# Altium schematic sheet PROC106B_BT_DISPLAY.SchDoc: BREAKAWAY_SECTION3
size 431 x 279 mm; Date: Not shown in title block; ApprovedBy: Not shown in title block; CheckedBy: Not shown in title block; Author: Not shown in title block; CompanyName: Not shown in title block; DrawnBy: Antony/Anand Ram; Engineer: Not shown in title block; Organization: Not shown in title block; Address1: Not shown in title block; Address2: Not shown in title block; Address3: Not shown in title block; Address4: Not shown in title block; DocumentNumber: 9; Revision: Use project parameter SCH_Rev; SheetNumber: 9; SheetTotal: 12; PageSetup: Record=PageOptions|CenterHorizontal=True|CenterVertical=True|PrintScale=1.00|XCorrection=1.00|YCorrection=1.00|PrintKind=0|BorderSize=5000000|LeftOffset=0|BottomOffset=0|Orientation=2|PaperLength=1000|PaperWidth=1000|Scale=100|PaperSource=15|PrintQuality=600|MediaType=1|DitherType=10|PaperKind=Letter|PrintScaleMode=1; CurrentTime: Not shown in title block; CurrentDate: Not shown in title block; Time: Not shown in title block; DocumentFullPathAndName: Not shown in title block; DocumentName: Not shown in title block; ModifiedDate: Not shown in title block; ImagePath: Not shown in title block
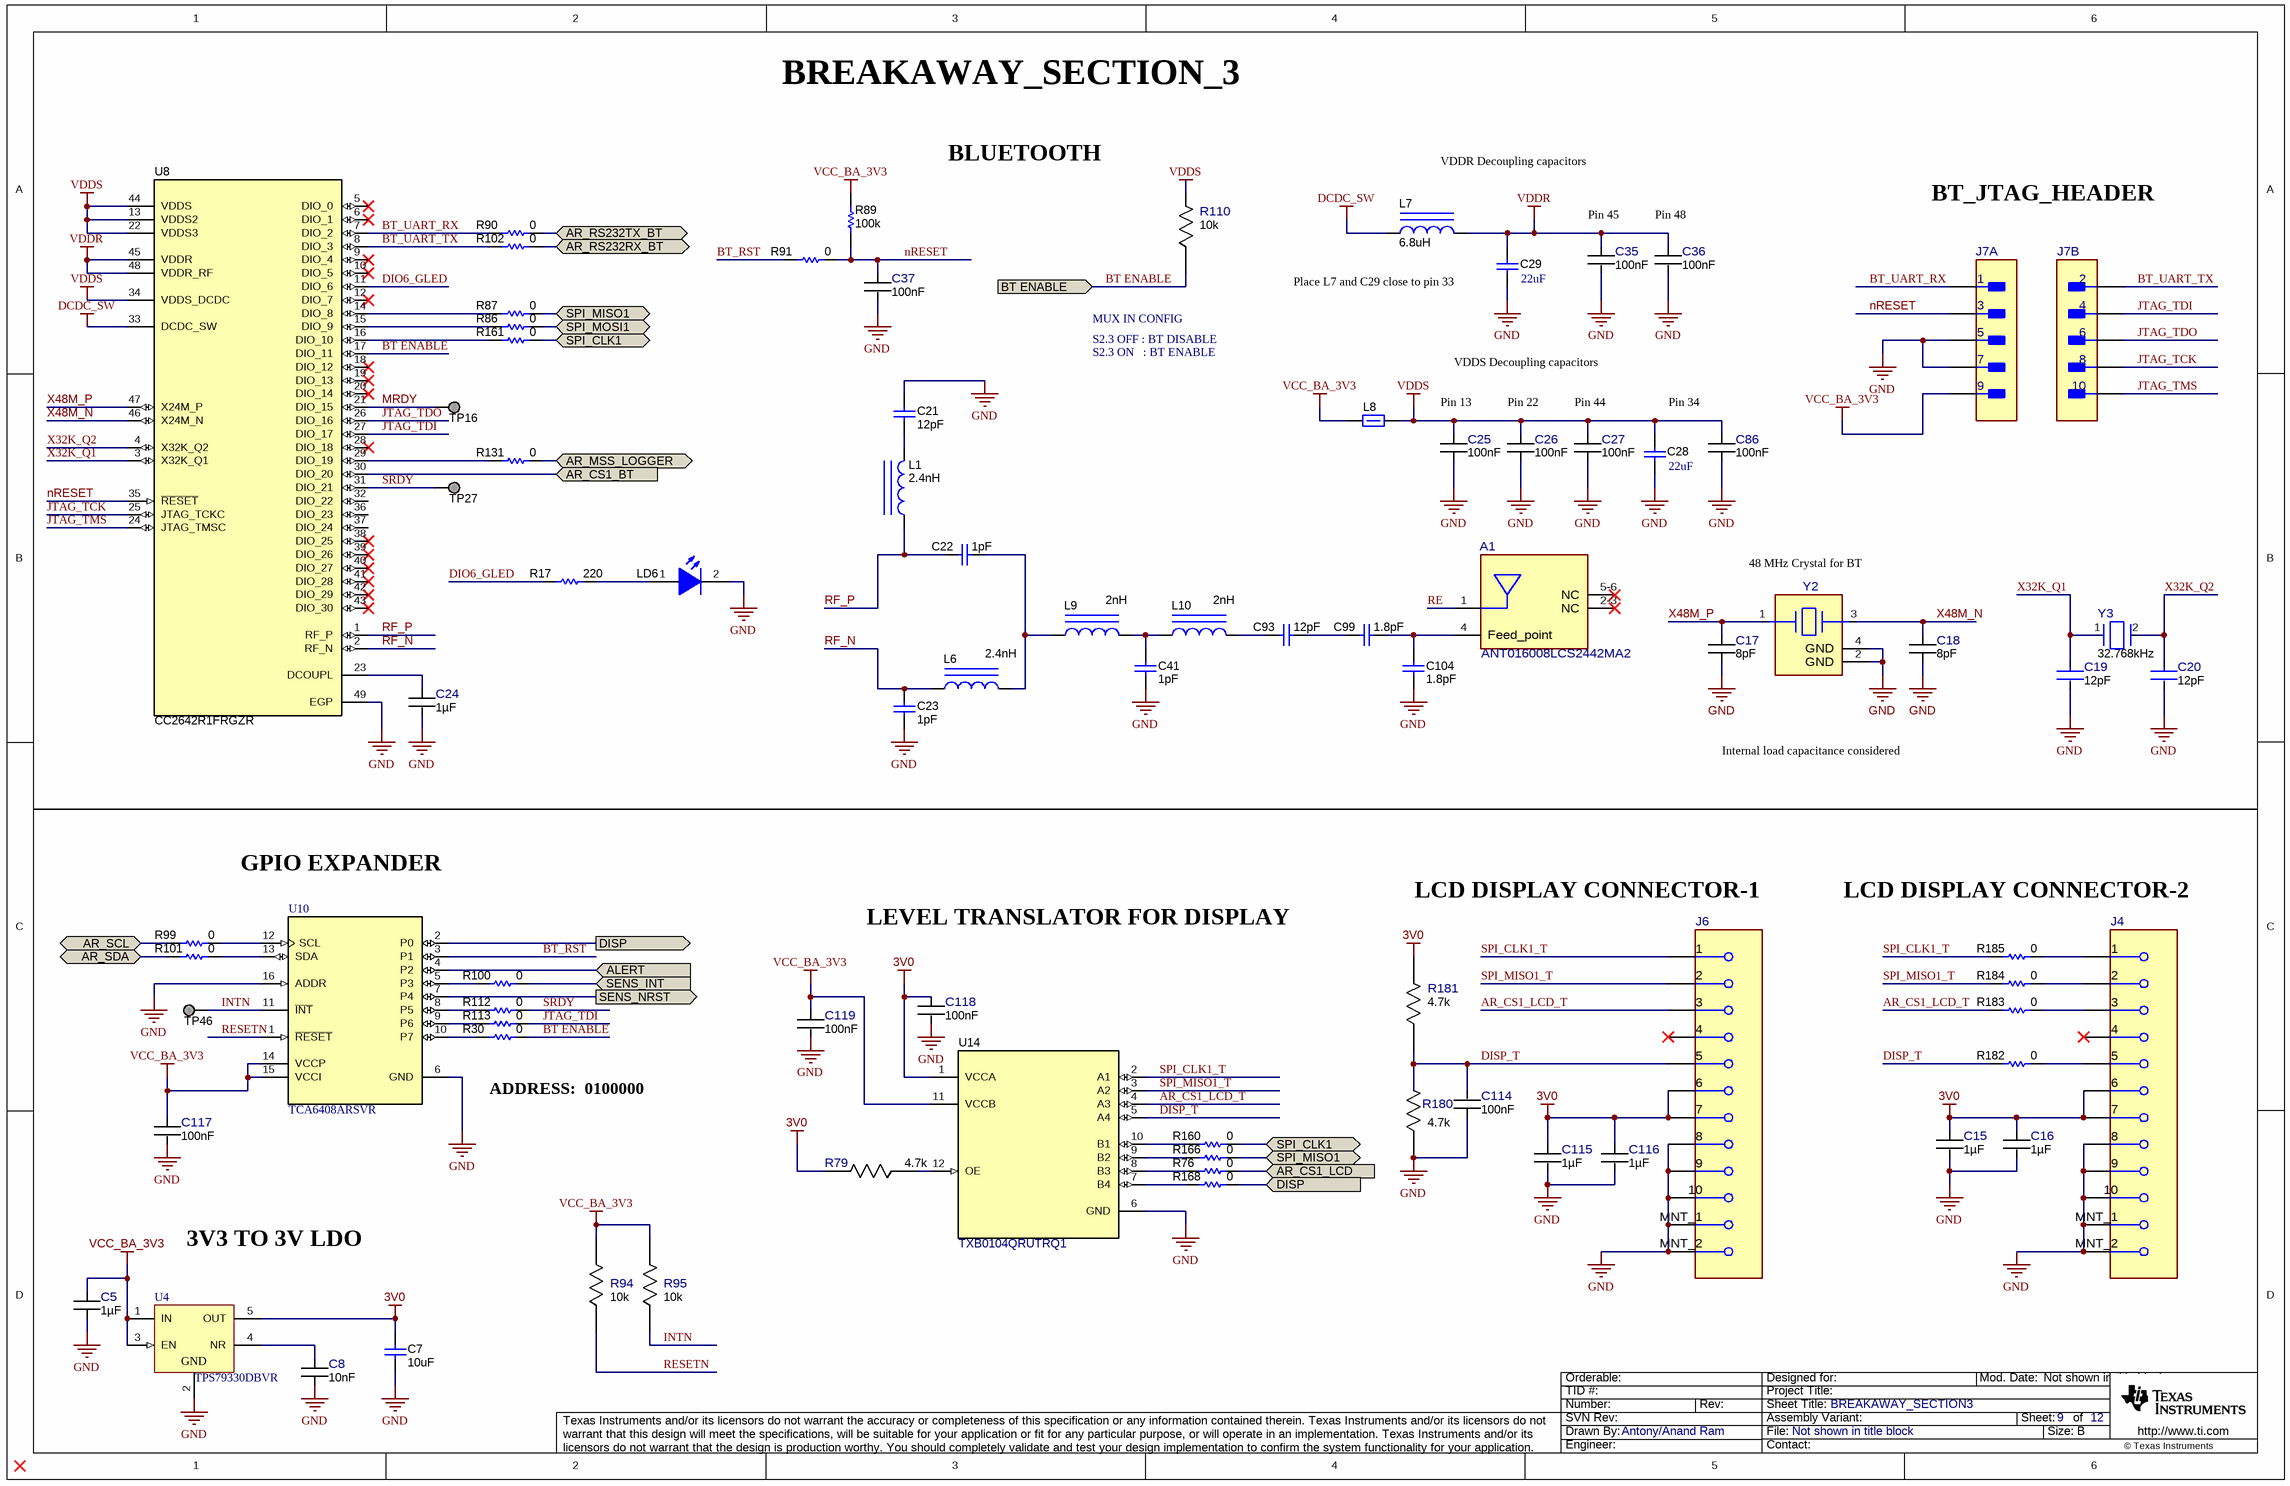
[diagram p0: PROC106B_BT_DISPLAY.SchDoc]

## Parts
A1  ANT016008LCS2442MA2  [FP-ANT016008LCS2442MA2_SMT_ANT-0]
C5  Cap_F: 1µF  [FP-CL03A105MO3NRNH_0201-IPC_C]  (hidden comment: CL03A105MO3NRNH)
C7  value 10uF  [0402_070]  (hidden comment: CL05A106MP5NUNC)
C8  Cap_F: 10nF  [FP-CL03A103KA3NNNC_0201-IPC_C]  (hidden comment: CL03A103KA3NNNC)
C15  Cap_F: 1µF  [FP-CL03A105MO3NRNH_0201-IPC_C]  (hidden comment: CL03A105MO3NRNH)
C16  Cap_F: 1µF  [FP-CL03A105MO3NRNH_0201-IPC_C]  (hidden comment: CL03A105MO3NRNH)
C17  Cap_F: 8pF  [FP-GRM0335C1H8R0BA01D_0201 (0603 metric)-IPC_C]  (hidden comment: GRM0335C1H8R0BA01D)
C18  Cap_F: 8pF  [FP-GRM0335C1H8R0BA01D_0201 (0603 metric)-IPC_C]  (hidden comment: GRM0335C1H8R0BA01D)
C19  Cap_F: 12pF  [FP-250R05L120JV4T_0201-IPC_C]  (hidden comment: 250R05L120JV4T)
C20  Cap_F: 12pF  [FP-250R05L120JV4T_0201-IPC_C]  (hidden comment: 250R05L120JV4T)
C21  ValueDisplayed: 12pF  [0402L]  (hidden comment: CL05C120JB5NNNC)
C22  ValueDisplayed: 1pF  [0402L]  (hidden comment: GCM1555C1H1R0CA16D)
C23  ValueDisplayed: 1pF  [0402L]  (hidden comment: GCM1555C1H1R0CA16D)
C24  Cap_F: 1µF  [FP-CL03A105MO3NRNH_0201-IPC_C]  (hidden comment: CL03A105MO3NRNH)
C25  Cap_F: 100nF  [FP-GRM033R6YA104KE14D_0201 (0603 Metric)-IPC_C]  (hidden comment: GRM033R6YA104KE14D)
C26  Cap_F: 100nF  [FP-GRM033R6YA104KE14D_0201 (0603 Metric)-IPC_C]  (hidden comment: GRM033R6YA104KE14D)
C27  Cap_F: 100nF  [FP-GRM033R6YA104KE14D_0201 (0603 Metric)-IPC_C]  (hidden comment: GRM033R6YA104KE14D)
C28  ValueDisplayed: 22uF  [0402S]  (hidden comment: CL05A226MQ5N6J8)
C29  ValueDisplayed: 22uF  [0402S]  (hidden comment: CL05A226MQ5N6J8)
C35  Cap_F: 100nF  [FP-GRM033R6YA104KE14D_0201 (0603 Metric)-IPC_C]  (hidden comment: GRM033R6YA104KE14D)
C36  Cap_F: 100nF  [FP-GRM033R6YA104KE14D_0201 (0603 Metric)-IPC_C]  (hidden comment: GRM033R6YA104KE14D)
C37  Cap_F: 100nF  [FP-GRM033R6YA104KE14D_0201 (0603 Metric)-IPC_C]  (hidden comment: GRM033R6YA104KE14D)
C41  ValueDisplayed: 1pF  [0402L]  (hidden comment: GCM1555C1H1R0CA16D)
C86  Cap_F: 100nF  [FP-GRM033R6YA104KE14D_0201 (0603 Metric)-IPC_C]  (hidden comment: GRM033R6YA104KE14D)
C93  ValueDisplayed: 12pF  [0402L]  (hidden comment: CL05C120JB5NNNC)
C99  ValueDisplayed: 1.8pF  [0402L]  (hidden comment: GJM1555C1H1R8BB01D)
C104  ValueDisplayed: 1.8pF  [0402L]  (hidden comment: GJM1555C1H1R8BB01D)
C114  Cap_F: 100nF  [FP-GRM033R6YA104KE14D_0201 (0603 Metric)-IPC_C]  (hidden comment: GRM033R6YA104KE14D)
C115  Cap_F: 1µF  [FP-CL03A105MO3NRNH_0201-IPC_C]  (hidden comment: CL03A105MO3NRNH)
C116  Cap_F: 1µF  [FP-CL03A105MO3NRNH_0201-IPC_C]  (hidden comment: CL03A105MO3NRNH)
C117  Cap_F: 100nF  [FP-GRM033R6YA104KE14D_0201 (0603 Metric)-IPC_C]  (hidden comment: GRM033R6YA104KE14D)
C118  Cap_F: 100nF  [FP-GRM033R6YA104KE14D_0201 (0603 Metric)-IPC_C]  (hidden comment: GRM033R6YA104KE14D)
C119  Cap_F: 100nF  [FP-GRM033R6YA104KE14D_0201 (0603 Metric)-IPC_C]  (hidden comment: GRM033R6YA104KE14D)
J4  51441-1093  [FP-51441-1093_CONN_SMD_FFC-0]  (value not drawn)
J6  51441-1093  [FP-51441-1093_CONN_SMD_FFC-0]  (value not drawn)
J7  GRPB052MWCN-RC  [FP-GRPB052MWCN-RC_HDR10-MFG]  (value not drawn)  (parts A,B of 2)
L1  ValueDisplayed: 2.4nH  [IND_LQG15H]  (hidden comment: LQG15HS2N4S02D)
L6  ValueDisplayed: 2.4nH  [IND_LQG15H]  (hidden comment: LQG15HS2N4S02D)
L7  ValueDisplayed: 6.8uH  [0805_HV]  (hidden comment: MLZ2012N6R8LT000)
L8  BLM18HE152SN1D  [0603L]  (value not drawn)
L9  ValueDisplayed: 2nH  [IND_LQG15H]  (hidden comment: LQG15HS2N0S02D)
L10  ValueDisplayed: 2nH  [IND_LQG15H]  (hidden comment: LQG15HS2N0S02D)
LD6  APHHS1005CGCK  [APHHS1005_Green]  (value not drawn)
R17  value 220  [0201L]  (hidden comment: RC0201JR-07220RL)
R30  Res_ohm: 0  [FP-RC0201JR-070RL_0201 (0603 Metric)-MFG]  (hidden comment: RC0201JR-070RL)
R76  Res_ohm: 0  [FP-RC0201JR-070RL_0201 (0603 Metric)-IPC_C]  (hidden comment: RC0201JR-070RL)
R79  Res_ohm: 4.7k  [FP-ERJ-1GNF4701C_0201-IPC_C]  (hidden comment: ERJ-1GNF4701C)
R86  Res_ohm: 0  [FP-RC0201JR-070RL_0201 (0603 Metric)-IPC_C]  (hidden comment: RC0201JR-070RL)
R87  Res_ohm: 0  [FP-RC0201JR-070RL_0201 (0603 Metric)-IPC_C]  (hidden comment: RC0201JR-070RL)
R89  value 100k  [0201L]  (hidden comment: CRCW0201100KFKED)
R90  Res_ohm: 0  [FP-RC0201JR-070RL_0201 (0603 Metric)-IPC_C]  (hidden comment: RC0201JR-070RL)
R91  Res_ohm: 0  [FP-RC0201JR-070RL_0201 (0603 Metric)-IPC_C]  (hidden comment: RC0201JR-070RL)
R94  Res_ohm: 10k  [FP-RR0306P-103-D_0201-IPC_C]  (hidden comment: RR0306P-103-D)
R95  Res_ohm: 10k  [FP-RR0306P-103-D_0201-IPC_C]  (hidden comment: RR0306P-103-D)
R99  Res_ohm: 0  [FP-RC0201JR-070RL_0201 (0603 Metric)-IPC_C]  (hidden comment: RC0201JR-070RL)
R100  Res_ohm: 0  [FP-RC0201JR-070RL_0201 (0603 Metric)-IPC_C]  (hidden comment: RC0201JR-070RL)
R101  Res_ohm: 0  [FP-RC0201JR-070RL_0201 (0603 Metric)-IPC_C]  (hidden comment: RC0201JR-070RL)
R102  Res_ohm: 0  [FP-RC0201JR-070RL_0201 (0603 Metric)-IPC_C]  (hidden comment: RC0201JR-070RL)
R110  Res_ohm: 10k  [FP-RR0306P-103-D_0201-IPC_C]  (hidden comment: RR0306P-103-D)
R112  Res_ohm: 0  [FP-RC0201JR-070RL_0201 (0603 Metric)-IPC_C]  (hidden comment: RC0201JR-070RL)
R113  Res_ohm: 0  [FP-RC0201JR-070RL_0201 (0603 Metric)-IPC_C]  (hidden comment: RC0201JR-070RL)
R131  Res_ohm: 0  [FP-RC0201JR-070RL_0201 (0603 Metric)-IPC_C]  (hidden comment: RC0201JR-070RL)
R160  Res_ohm: 0  [FP-RC0201JR-070RL_0201 (0603 Metric)-IPC_C]  (hidden comment: RC0201JR-070RL)
R161  Res_ohm: 0  [FP-RC0201JR-070RL_0201 (0603 Metric)-IPC_C]  (hidden comment: RC0201JR-070RL)
R166  Res_ohm: 0  [FP-RC0201JR-070RL_0201 (0603 Metric)-IPC_C]  (hidden comment: RC0201JR-070RL)
R168  Res_ohm: 0  [FP-RC0201JR-070RL_0201 (0603 Metric)-IPC_C]  (hidden comment: RC0201JR-070RL)
R180  Res_ohm: 4.7k  [FP-ERJ-1GNF4701C_0201-IPC_C]  (hidden comment: ERJ-1GNF4701C)
R181  Res_ohm: 4.7k  [FP-ERJ-1GNF4701C_0201-IPC_C]  (hidden comment: ERJ-1GNF4701C)
R182  Res_ohm: 0  [FP-RC0201JR-070RL_0201 (0603 Metric)-IPC_C]  (hidden comment: RC0201JR-070RL)
R183  Res_ohm: 0  [FP-RC0201JR-070RL_0201 (0603 Metric)-IPC_C]  (hidden comment: RC0201JR-070RL)
R184  Res_ohm: 0  [FP-RC0201JR-070RL_0201 (0603 Metric)-IPC_C]  (hidden comment: RC0201JR-070RL)
R185  Res_ohm: 0  [FP-RC0201JR-070RL_0201 (0603 Metric)-IPC_C]  (hidden comment: RC0201JR-070RL)
TP16  TESTPOINT  [TP_25MIL-SMT]  (value not drawn)  (no BOM)
TP27  TESTPOINT  [TP_25MIL-SMT]  (value not drawn)  (no BOM)
TP46  TESTPOINT  [TP_25MIL-SMT]  (value not drawn)  (no BOM)
U4  TPS79330DBVR  [DBV0005A_N]
U8  CC2642R1FRGZR  [RGZ0048A]
U10  TCA6408ARSVR  [RSV0016A]
U14  TXB0104QRUTRQ1  [RUT0012A]
Y2  CX2016DB48000C0WPLA2  [FP-CX2016DB48000C0WPLA2_SMD4-MFG]  (value not drawn)
Y3  Frequency_Fixed: 32.768kHz  [FP-ABS05W-32.768KHZ-D-2-T_XTAL_SMT_1MM6_1MM0-MFG]  (hidden comment: ABS05W-32.768KHZ-D-2-T)

## Ports
ALERT (in), AR_CS1_BT (in), AR_CS1_LCD (in), AR_MSS_LOGGER (bidir), AR_RS232RX_BT (bidir), AR_RS232TX_BT (bidir), AR_SCL (bidir), AR_SDA (bidir), BT ENABLE (in), DISP (in), DISP (out), SENS_INT (in), SENS_NRST (out), SPI_CLK1 (bidir), SPI_MISO1 (bidir), SPI_MOSI1 (bidir)

## Nets
3V0: C7.1 C15.1 C16.1 C115.1 C116.1 C118.1 J4.6 J4.7 J6.6 J6.7 R79.2 R181.2 U4.5(OUT) U14.1(VCCA)
DCDC_SW: L7.1 U8.33(DCDC_SW)
GND: C5.2 C7.2 C8.2 C15.2 C16.2 C17.2 C18.2 C19.2 C20.2 C21.1 C23.2 C24.2 C25.2 C26.2 C27.2 C28.2 C29.2 C35.2 C36.2 C37.2 C41.2 C86.2 C104.2 C114.1 C115.2 C116.2 C117.2 C118.2 C119.2 J4.8 J4.9 J4.10 J4.11(MNT_1) J4.12(MNT_2) J6.8 J6.9 J6.10 J6.11(MNT_1) J6.12(MNT_2) J7.5 J7.7 LD6.2(K) R180.1 U4.2(GND) U8.49(EGP) U10.6(GND) U10.16(ADDR) U14.6(GND) Y2.2(GND) Y2.4(GND)
VCC_BA_3V3: C5.1 C117.1 C119.1 J7.9 L8.1 R89.2 R94.2 R95.2 U4.1(IN) U4.3(EN) U10.14(VCCP) U10.15(VCCI) U14.11(VCCB)
VDDR: C29.1 C35.1 C36.1 L7.2 U8.45(VDDR) U8.48(VDDR_RF)
VDDS: C25.1 C26.1 C27.1 C28.1 C86.1 L8.2 R110.2 U8.13(VDDS2) U8.22(VDDS3) U8.34(VDDS_DCDC) U8.44(VDDS)
ALERT: U10.4(P2) ; port ALERT
AR_CS1_BT: U8.30(DIO_20) ; port AR_CS1_BT
AR_CS1_LCD: R76.2 ; port AR_CS1_LCD
AR_CS1_LCD_T: J6.3 R183.1 U14.4(A3)
AR_MSS_LOGGER: R131.1 ; port AR_MSS_LOGGER
AR_RS232RX_BT: R102.1 ; port AR_RS232RX_BT
AR_RS232TX_BT: R90.1 ; port AR_RS232TX_BT
AR_SCL: R99.2 ; port AR_SCL
AR_SDA: R101.2 ; port AR_SDA
BT ENABLE: R30.1 R110.1 U8.17(DIO_11) ; port BT ENABLE
BT_RST: R91.2 U10.3(P1)
BT_UART_RX: J7.1 R90.2 U8.7(DIO_2)
BT_UART_TX: J7.2 R102.2 U8.8(DIO_3)
DIO6_GLED: R17.1 U8.11(DIO_6)
DISP: R168.2 U10.2(P0) ; port DISP
DISP_T: C114.2 J6.5 R180.2 R181.1 R182.1 U14.5(A4)
INTN: R95.1 TP46.1 U10.11(~{INT})
JTAG_TCK: J7.8 U8.25(JTAG_TCKC)
JTAG_TDI: J7.4 R113.1 U8.27(DIO_17)
JTAG_TDO: J7.6 U8.26(DIO_16)
JTAG_TMS: J7.10 U8.24(JTAG_TMSC)
MRDY: TP16.1 U8.21(DIO_15)
nRESET: C37.1 J7.3 R89.1 R91.1 U8.35(~{RESET})
RE: A1.1(Radiator_electrode)
RESETN: R94.1 U10.1(~{RESET})
RF_N: C23.1 L6.1 U8.2(RF_N)
RF_P: C22.2 L1.1 U8.1(RF_P)
SENS_INT: R100.1 ; port SENS_INT
SENS_NRST: U10.7(P4) ; port SENS_NRST
SPI_CLK1: R160.2 R161.1 ; port SPI_CLK1
SPI_CLK1_T: J6.1 R185.1 U14.2(A1)
SPI_MISO1: R87.1 R166.2 ; port SPI_MISO1
SPI_MISO1_T: J6.2 R184.1 U14.3(A2)
SPI_MOSI1: R86.1 ; port SPI_MOSI1
SRDY: R112.1 TP27.1 U8.31(DIO_21)
X32K_Q1: C19.1 U8.3(X32K_Q1) Y3.1
X32K_Q2: C20.1 U8.4(X32K_Q2) Y3.2
X48M_N: C18.1 U8.46(X24M_N) Y2.3(2_HOT)
X48M_P: C17.1 U8.47(X24M_P) Y2.1(1_HOT)
NetA1_4: A1.4(Feed_point) C99.1 C104.1
NetC8_1: C8.1 U4.4(NR)
NetC21_2: C21.2 L1.2
NetC22_1: C22.1 L6.2 L9.1
NetC24_1: C24.1 U8.23(DCOUPL)
NetC41_1: C41.1 L9.2 L10.1
NetC93_1: C93.1 C99.2
NetC93_2: C93.2 L10.2
NetJ4_1: J4.1 R185.2
NetJ4_2: J4.2 R184.2
NetJ4_3: J4.3 R183.2
NetJ4_5: J4.5 R182.2
NetLD6_1: LD6.1(A) R17.2
NetR30_2: R30.2 U10.10(P7)
NetR76_1: R76.1 U14.8(B3)
NetR79_1: R79.1 U14.12(OE)
NetR86_2: R86.2 U8.15(DIO_9)
NetR87_2: R87.2 U8.14(DIO_8)
NetR99_1: R99.1 U10.12(SCL)
NetR100_2: R100.2 U10.5(P3)
NetR101_1: R101.1 U10.13(SDA)
NetR112_2: R112.2 U10.8(P5)
NetR113_2: R113.2 U10.9(P6)
NetR131_2: R131.2 U8.29(DIO_19)
NetR160_1: R160.1 U14.10(B1)
NetR161_2: R161.2 U8.16(DIO_10)
NetR166_1: R166.1 U14.9(B2)
NetR168_1: R168.1 U14.7(B4)

Not connected (* = marked no-connect by the designer): A1 2-3(NC)* 5-6(NC)*; J4 4*; J6 4*; U8 5(DIO_0)* 6(DIO_1)* 9(DIO_4)* 10(DIO_5)* 12(DIO_7)* 18(DIO_12)* 19(DIO_13)* 20(DIO_14)* 28(DIO_18)* 32(DIO_22) 36(DIO_23) 37(DIO_24) 38(DIO_25)* 39(DIO_26)* 40(DIO_27)* 41(DIO_28)* 42(DIO_29)* 43(DIO_30)*

## Notes on the sheet
- BREAKAWAY_SECTION_3
- BLUETOOTH
- VDDR Decoupling capacitors
- Pin 45
- (near C36) Pin 48
- BT_JTAG_HEADER
- Place L7 and C29 close to pin 33
- MUX IN CONFIG
- S2.3 ON   : BT ENABLE
- S2.3 OFF : BT DISABLE
- VDDS Decoupling capacitors
- Pin 13
- Pin 22
- Pin 44
- Pin 34
- 48 MHz Crystal for BT
- Internal load capacitance considered
- GPIO EXPANDER
- LCD DISPLAY CONNECTOR-1
- LCD DISPLAY CONNECTOR-2
- LEVEL TRANSLATOR FOR DISPLAY
- ADDRESS:  0100000
- 3V3 TO 3V LDO
- Drawn By:
- SVN Rev:
- Number:
- TID #:
- Orderable:
- Rev:
- Sheet Title:
- File:
- Project Title:
- Designed for:
- Assembly Variant:
- Mod. Date:
- Sheet:
- Size:
- of
- B
- http://www.ti.com
- Texas Instruments and/or its licensors do not warrant the accuracy or completeness of this specification or any information contained therein. Texas Instruments and/or its licensors do not warrant that this design will meet the specifications, will be suitable for your application or fit for any particular purpose, or will operate in an implementation. Texas Instruments and/or its licensors do not warrant that the design is production worthy. You should completely validate and test your design implementation to confirm the system functionality for your application.
- Engineer:
- Contact:
- © Texas Instruments

## Library data of the parts
A1 = CMP-0087189-1: RF ANT 2.4GHZ CHIP SOLDER SMD; Manufacturer: TDK Corporation; SizeZ_mm: 0.4mm; RoHS: TRUE; PackageReference: SMT_ANT; PartNumber: ANT016008LCS2442MA2; Symbol Name: SYM-ANT016008LCS2442MA2
C5 C15 C16 C24 C115 C116 = CMP-0086446-1: 1µF ±20% 16V Ceramic Capacitor X5R 0201; Manufacturer: Samsung Electro-Mechanics; AEC Qualified: No; SizeZ_mm: 0.39mm; Symbol Name: SYM-CL03A105MO3NRNH; TempCo: 15%; RoHS: TRUE; ComponentLink1Description: Datasheet; ComponentLink1URL: http://www.samsungsem.com/global/front/downloadcms.do?path=%2F%2Fglobal%2F%2Fsupport%2F%2Fproduct-search%2F%2Fmlcc%2F%2F__icsFiles%2F%2Fafieldfile%2F%2F2018%2F%2F06%2F%2F21&fileName=CL03A105MO3NRNH.pdf; PackageReference: 0201; PartNumber: CL03A105MO3NRNH; Tolerance_%: 20%; VDC_V: 16V
C7 = CMP-0006339-4: CAP, CERM, 10 uF, 10 V, +/- 20%, X5R, 0402; Manufacturer: Samsung Electro-Mechanics; AEC Category: Q200; AEC Qualified: N; Cap_Case: 0402; Cap_F: 10µF; SizeArea_mm2: 0.5; SizeAreaWB_mm2: 3; SizeX_mm: 1; SizeZ_mm: 0.6; TaMax_C: 85°C; TaMin_C: -55°C; U/M: EA; Value1: Unknown; Value2: 10V; RoHS: Y; AEC Grade: N/A; ComponentLink1Description: Datasheet link; ComponentLink1URL: http://www.samsungsem.com/kr/support/product-search/mlcc/__icsFiles/afieldfile/2018/06/21/CL05A106MP5NUNC.pdf; CompType: Capacitor; MountType: SMT; PackageReference: 0402; PartNumber: CL05A106MP5NUNC; Polarized: N; SizeY_mm: 0.5; Technology: Ceramic; TempCo: X5R; Tolerance_%: 20%; ValueDisplayed: 10uF; VDC_V: 10V
C8 = CMP-0086445-1: CAP CER 10000PF 25V X5R 0201; Manufacturer: Samsung Electro-Mechanics America, Inc; AEC Qualified: No; SizeZ_mm: 0.33mm; Symbol Name: SYM-CL03A103KA3NNNC; TempCo: 15%; Tolerance_%: 10%; RoHS: TRUE; ComponentLink1Description: Datasheet; ComponentLink1URL: http://www.samsungsem.com/global/front/downloadcms.do?path=%2F%2Fglobal%2F%2Fsupport%2F%2Fproduct-search%2F%2Fmlcc%2F%2F__icsFiles%2F%2Fafieldfile%2F%2F2018%2F%2F06%2F%2F19&fileName=CL03A103KA3NNNC.pdf; PackageReference: 0201; PartNumber: CL03A103KA3NNNC; VDC_V: 25V
C17 C18 = CMP-0086441-1: Cap Ceramic 8pF 50V C0G 0.1pF SMD 0201 125°C Paper T/R; Manufacturer: Murata; AEC Qualified: No; SizeZ_mm: 0.33mm; Symbol Name: SYM-GRM0335C1H8R0BA01D; TempCo: 30ppm/°C; RoHS: TRUE; ComponentLink1Description: Datasheet; ComponentLink1URL: https://search.murata.co.jp/Ceramy/image/img/A01X/G101/ENG/GRM0335C1H8R0BA01-01A.pdf; PackageReference: 0201 (0603 metric); PartNumber: GRM0335C1H8R0BA01D; VDC_V: 50V
C19 C20 = CMP-0087190-1: CAP CER 12PF 25V C0G/NP0 0201; Manufacturer: Johanson Technology Inc.; AEC Grade: Grade 1; AEC Qualified: Yes; SizeZ_mm: 0.33mm; Symbol Name: SYM-250R05L120JV4T; TempCo: 30ppm/°C; Tolerance_%: 5%; RoHS: TRUE; ComponentLink1Description: Datasheet; ComponentLink1URL: https://www.johansontechnology.com/downloads/catalog/johanson-technology-multi-layer-high-q-capacitors.pdf; PackageReference: 0201; PartNumber: 250R05L120JV4T; VDC_V: 25V
C21 C93 = CMP-0006345-2: CAP, CERM, 12 pF, 50 V, +/- 5%, C0G/NP0, 0402; Manufacturer: Samsung Electro-Mechanics; TaMin_C: -55°C; Polarized: N; SizeAreaWB_mm2: 3; Value1: Unknown; U/M: EA; Value: 12pF; TaMax_C: 125°C; SizeZ_mm: 0.6; SizeX_mm: 1; SizeY_mm: 0.5; Cap_Case: 0402; Value2: 50V; AEC Category: Q200; Publisher: Texas Instruments; TempCo: C0G/NP0; Published: 2008-06-19; RoHS: Y; MountType: SMT; Supplier 1: Digi-Key; PackageReference: 0402; Tolerance_%: 5%; SizeArea_mm2: 0.5; CompType: Capacitor; LatestRevisionDate: 2017-03-09; PartNumber: CL05C120JB5NNNC; AEC Qualified: N; Cap_F: 12pF; VDC_V: 50V; ComponentLink1Description: Datasheet link; AEC Grade: N/A; Supplier Part Number 1: 1276-1178-1-ND; Technology: Ceramic; ComponentLink1URL: http://www.samsungsem.com/servlet/FileDownload?type=spec&file=CL05C120JB5NNNC.pdf
C22 C23 C41 = CMP-0085178-1: CAP, CERM, 1 pF, 50 V,+/- 25%, C0G/NP0, AEC-Q200 Grade 1, 0402; Manufacturer: MuRata; SizeX_mm: 1; Polarized: N; AEC Qualified: Y; AEC Category: Q200; VDC_V: 50V; Cap_Case: 0402; TaMax_C: 125°C; TaMin_C: -55°C; U/M: EA; Value: 1pF; SizeY_mm: 0.5; SizeAreaWB_mm2: 3; SizeZ_mm: 0.6; Cap_F: 1pF; MountType: SMT; ComponentLink1Description: Datasheet link; TempCo: C0G/NP0; PackageReference: 0402; Tolerance_%: 25%; Value2: 50V; AEC Grade: 1; Technology: Ceramic; ComponentLink1URL: https://psearch.en.murata.com/capacitor/product/GCM1555C1H1R0CA16%23.html; PartNumber: GCM1555C1H1R0CA16D; SizeArea_mm2: 0.5; RoHS: Y; CompType: Capacitor
C25-C27 C35-C37 C86 C114 C117-C119 = CMP-0086440-1: Cap Ceramic 0.1uF 35V X5R 10% Pad SMD 0201 85C T/R; Manufacturer: Murata Electronics North America; AEC Qualified: No; SizeZ_mm: 0.33mm; Symbol Name: SYM-GRM033R6YA104KE14D; TempCo: 15%; RoHS: TRUE; ComponentLink1Description: Datasheet; ComponentLink1URL: https://search.murata.co.jp/Ceramy/image/img/A01X/G101/ENG/GRM033R6YA104KE14-01.pdf; PackageReference: 0201 (0603 Metric); PartNumber: GRM033R6YA104KE14D; Tolerance_%: 10%; VDC_V: 35V
C28 C29 = CMP-0089043-4: CAP CER 22UF 6.3V X5R 0402; Manufacturer: Samsung Electro-Mechanics; AEC Qualified: No; Cap_F: 22µF; SizeZ_mm: 0.55mm; TempCo: 15%; Tolerance_%: 20%; RoHS: TRUE; ComponentLink1Description: Datasheet; ComponentLink1URL: http://www.samsungsem.com/kr/support/library/product-catalog/__icsFiles/afieldfile/2018/11/28/MLCC.pdf; PackageReference: 0402; PartNumber: CL05A226MQ5N6J8; VDC_V: 6.3V; Part Number: CL05A226MQ5N6J8
C99 C104 = CMP-0086306-1: CAP, CERM, 1.8 pF, 50 V,+/- 6%, C0G/NP0, 0402; Manufacturer: MuRata; VDC_V: 50V; SizeZ_mm: 0.6; SizeAreaWB_mm2: 3; SizeArea_mm2: 0.5; Polarized: N; TaMax_C: 125°C; Cap_Case: 0402; SizeX_mm: 1; Value: 1.8pF; U/M: EA; TaMin_C: -55°C; AEC Category: Q200; PackageReference: 0402; Technology: Ceramic; CompType: Capacitor; PartNumber: GJM1555C1H1R8BB01D; MountType: SMT; SizeY_mm: 0.5; ComponentLink1URL: https://search.murata.co.jp/Ceramy/image/img/A01X/G101/ENG/GJM1555C1H1R8BB01-01.pdf; ComponentLink1Description: Datasheet link; RoHS: Y; TempCo: C0G/NP0; Tolerance_%: 6%; Value2: 50V; AEC Qualified: N; AEC Grade: N/A; Cap_F: 1.8pF
J4 J6 = CMP-0086453-1: Easy-On™ Type FFC/FPC Connector, Right-Angle, Surface Mount, ZIF, Bottom Contact Style, 1.10mm Mated Height, 10 Circuits; Manufacturer: Molex; RoHS: TRUE; ComponentLink1Description: Datasheet; ComponentLink1URL: http://www.molex.com/pdm_docs/sd/514411093_sd.pdf; PackageReference: CONN_SMD_FFC; PartNumber: 51441-1093; Symbol Name: SYM-51441-1093
J7 = CMP-0087786-1: CONN HEADER R/A 10POS 1.27MM; Manufacturer: Sullins; Row_Count: 2; Current_A: 1A; ContactFinish: Gold; RoHS: TRUE; ComponentLink1Description: Datasheet; ComponentLink1URL: https://s3.amazonaws.com/catalogspreads-pdf/PAGE94-95%20.050%20MALE%20HDR%20ST%20RA%20SMT.pdf; Symbol Name: SYM-GRPB052MWCN-RC; PinCount: 10; PackageReference: HDR10; PartNumber: GRPB052MWCN-RC; PartId: 1
L1 L6 = CMP-0058626-1: Inductor, Multilayer, Air Core, 2.4 nH, 0.3 A, 0.15 ohm, SMD; Manufacturer: MuRata; Isat: 0.3A @ % inductance drop; Irms: 0.3A @ C rise; Green_Lifecycle: Active; SizeAreaWB_mm2: 3; DCR_ohm: 0.15; Green_REACh: Passed; Value: 2.4nH; Imax_A: 300mA; SizeZ_mm: 0.55; SizeX_mm: 1; SizeY_mm: 0.5; Value2: 0.3A; AEC Category: Q200; ComponentLink1URL: http://search.murata.co.jp/Ceramy/image/img/PDF/ENG/L0075S0083LQG15HS.pdf; Supplier Part Number 2: 81-LQG15HS2N4S02D; Publisher: Texas Instruments; Supplier 2: Mouser; Published: 2008-06-26; RoHS: Y; Value1: 0.15 ohm; Material: Air Core; MountType: SMT; Green_EU RoHS-2: Incomplete; Supplier 1: Digi-Key; Green_EU RoHS: Passed; PackageReference: 0402 polarized; SizeArea_mm2: 0.5; CompType: Inductor; Ind_H: 2.4nH; LatestRevisionDate: 2017-06-02; PartNumber: LQG15HS2N4S02D; AEC Qualified: ?; ComponentLink1Description: Datasheet link; Supplier Part Number 1: LQG15HS2N4S02D-ND; Technology: Multilayer
L7 = CMP-0062727-1: Inductor, Multilayer, Ferrite, 6.8 uH, 0.11 A, 0.25 ohm, SMD; Manufacturer: TDK; Isat: 0.11A @ 50% inductance drop; Irms: 0.55A @ 20C rise; Green_Lifecycle: Active; SizeAreaWB_mm2: 6.75; DCR_ohm: 0.25; Green_REACh: Passed; Value: 6.8uH; Imax_A: 110mA; SizeZ_mm: 1.45; SizeX_mm: 2; SizeY_mm: 1.25; Value2: 0.11A; SizeArea_mm2: 2.5; Ind_H: 6.8µH; AEC Category: Q200; ComponentLink1URL: http://product.tdk.com/en/catalog/datasheets/inductor_commercial_decoupling_mlz_en.pdf; Publisher: Texas Instruments; Published: 2008-06-26; RoHS: Y; Value1: 0.25 ohm; Material: Ferrite; MountType: SMT; Green_EU RoHS-2: Incomplete; Supplier 1: Digi-Key; Green_EU RoHS: Passed; PackageReference: 0805; CompType: Inductor; LatestRevisionDate: 2017-06-02; PartNumber: MLZ2012N6R8LT000; AEC Qualified: ?; ComponentLink1Description: Datasheet link; Supplier Part Number 1: 445-6761-1-ND; Technology: Multilayer
L8 = CMP-0003349-2: Ferrite Bead, 1500 ohm @ 100 MHz, 0.5 A, 0603; Manufacturer: MuRata; Ztyp@1GHz_Ohm: 1.5k; SizeAreaWB_mm2: 4.68; DCR_ohm: 0.5; Value1: 0.5 ohm; Imax_A: 500mA; SizeZ_mm: 1; SizeX_mm: 1.6; SizeY_mm: 0.8; Value2: 0.5A; SizeArea_mm2: 1.28; ComponentLink1URL: http://search.murata.co.jp/Ceramy/image/img/PDF/ENG/L0110S0101BLM18H.pdf; Supplier Part Number 2: 87X8574; Publisher: Texas Instruments; Supplier 2: Newark; Supplier Part Number 3: 81-BLM18HE152SN1D; ZTyp@100MHz_Ohm: 1.5k; Supplier 3: Mouser; Published: 2014-04-30; RoHS: Y; MountType: SMT; Value: 1500 ohm; Supplier 1: Digi-Key; PackageReference: 0603; CompType: Ferrite Bead; LatestRevisionDate: 2017-03-09; PartNumber: BLM18HE152SN1D; ComponentLink1Description: Datasheet link; Supplier Part Number 1: 490-5216-1-ND; ValueDisplayed: 1500 ohm
L9 L10 = CMP-0058624-1: Inductor, Multilayer, Air Core, 2 nH, 0.3 A, 0.1 ohm, SMD; Manufacturer: MuRata; Isat: 0.3A @ % inductance drop; Irms: 0.3A @ C rise; Green_Lifecycle: Active; SizeAreaWB_mm2: 3; DCR_ohm: 0.1; Green_REACh: Passed; Value1: 0.1 ohm; Value: 2nH; Imax_A: 300mA; SizeZ_mm: 0.55; SizeX_mm: 1; SizeY_mm: 0.5; Value2: 0.3A; AEC Category: Q200; ComponentLink1URL: http://search.murata.co.jp/Ceramy/image/img/PDF/ENG/L0075S0083LQG15HS.pdf; Supplier Part Number 2: 81-LQG15HS2N0S02D; Publisher: Texas Instruments; Supplier 2: Mouser; Published: 2008-06-26; RoHS: Y; Material: Air Core; MountType: SMT; Green_EU RoHS-2: Incomplete; Supplier 1: Digi-Key; Green_EU RoHS: Passed; PackageReference: 0402 polarized; SizeArea_mm2: 0.5; CompType: Inductor; Ind_H: 2nH; LatestRevisionDate: 2017-06-02; PartNumber: LQG15HS2N0S02D; AEC Qualified: ?; ComponentLink1Description: Datasheet link; Supplier Part Number 1: 490-6569-1-ND; Technology: Multilayer
LD6 = CMP-0067682-2: LED, Green, SMD; Manufacturer: Kingbright; Angle: 120.0; Power_TotalModule: 75mW; SizeZ_mm: 0.6; Vf_V: 2.1V; Vr_V: 5V; Io_A: 20mA; Ir_A: 10µA; SizeArea_mm2: 0.5; SizeAreaWB_mm2: 3.0; SizeX_mm: 1.0; Tjmax_C: 85°C; Value1: 0.075W; RoHS: Y; Color: Green; ComponentLink1Description: Datasheet link; ComponentLink1URL: http://www.kingbrightusa.com/images/catalog/SPEC/APHHS1005CGCK.pdf; PackageReference: 0402; PartNumber: APHHS1005CGCK; CompType: LED; MountType: SMT; SizeY_mm: 0.5; Type: ?; Value2: 2.1V; Value: Green
R17 = CMP-0027072-1: RES, 220, 5%, 0.05 W, 0201; Manufacturer: Yageo America; AEC Category: Q200; AEC Qualified: N; EIA_Code: E24; Power_W: 50mW; SizeArea_mm2: 0.18; SizeX_mm: 0.6; SizeY_mm: 0.3; SizeZ_mm: 0.26; TempCo: 200 ppm/C; U/M: EA; Value2: 0.05W; Value_Code: 220R; VDC_V: 25V; RoHS: Y; AEC Grade: N/A; ComponentLink1Description: Datasheet link; ComponentLink1URL: http://www.yageo.com/documents/recent/PYu-RC_Group_51_RoHS_L_5.pdf; CompType: Resistor; LatestRevisionDate: 2017-03-09; MountType: SMT; PackageReference: 0201; PartNumber: RC0201JR-07220RL; Published: 2016-10-14; Publisher: Texas Instruments; Res_ohm: 220; Supplier 1: Digi-Key; Supplier 2: Mouser; Supplier Part Number 1: 311-220NCT-ND; Supplier Part Number 2: 603-RC0201JR-07220RL; Technology: Thick Film; Tolerance_%: 5%; Value1: 5%; ValueDisplayed: 220
R30 R76 R86 R87 R90 R91 R99-R102 R112 R113 R131 R160 R161 R166 R168 R182-R185 = CMP-0086442-2: RES SMD 0 OHM JUMPER 1/20W 0201; Manufacturer: Yageo; AEC Qualified: No; Power_W: 50mW; SizeZ_mm: 0.26mm; TempCo: 200ppm/°C; Tolerance_%: 5%; VDC_V: 25V; RoHS: TRUE; ComponentLink1Description: Datasheet; ComponentLink1URL: http://www.yageo.com/documents/recent/PYu-RC_Group_51_RoHS_L_10.pdf; PackageReference: 0201 (0603 Metric); PartNumber: RC0201JR-070RL; Technology: Thick Film
R79 R180 R181 = CMP-0087184-1: RESISTOR, 0201, 0.05W, 1%, 4K7; Manufacturer: Panasonic Electronic Components; AEC Grade: Grade 1; AEC Qualified: Yes; Power_W: 50mW; SizeZ_mm: 0.26mm; Symbol Name: SYM-ERJ-1GNF4701C; TempCo: 200ppm/°C; VDC_V: 25V; RoHS: TRUE; ComponentLink1Description: Datasheet; ComponentLink1URL: https://industrial.panasonic.com/cdbs/www-data/pdf/RDA0000/AOA0000C304.pdf; PackageReference: 0201; PartNumber: ERJ-1GNF4701C; Technology: Thick Film; Tolerance_%: 1%
R89 = CMP-0027261-3: RES, 100 k, 1%, 0.05 W, 0201; Manufacturer: Vishay-Dale; AEC Category: Q200; AEC Qualified: N; EIA_Code: E96; Power_W: 50mW; SizeArea_mm2: 0.18; SizeX_mm: 0.6; SizeY_mm: 0.3; SizeZ_mm: 0.26; TempCo: 100 ppm/C; Value2: 0.05W; VDC_V: 30V; RoHS: E; AEC Grade: N/A; ComponentLink1Description: Datasheet link; ComponentLink1URL: http://www.vishay.com/docs/20052/crcw0201e3.pdf; CompType: Resistor; MountType: SMT; PackageReference: 0201; PartNumber: CRCW0201100KFKED; Res_ohm: 100k; Supplier 1: Digi-Key; Supplier 2: Newark; Supplier 3: Mouser; Supplier Part Number 1: 541-100KAABCT-ND; Supplier Part Number 2: 84R1457; Supplier Part Number 3: 71-CRCW0201100KFKED; Technology: Thick Film; Tolerance_%: 1%; Value1: 1%; Value_Code: 100k; ValueDisplayed: 100k
R94 R95 R110 = CMP-0088002-1: 10 kOhms ±0.5% 0.05W, 1/20W Chip Resistor 0201 (0603 Metric)  Thin Film; Manufacturer: Susumu; AEC Qualified: No; Power_W: 50mW; SizeZ_mm: 0.26mm; Symbol Name: SYM-RR0306P-103-D; TempCo: 25ppm/°C; VDC_V: 15V; RoHS: TRUE; ComponentLink1Description: Datasheet; ComponentLink1URL: https://www.susumu.co.jp/common/pdf/n_catalog_partition05_en.pdf; PackageReference: 0201; PartNumber: RR0306P-103-D; Technology: Thin Film; Tolerance_%: 0.5%
TP16 TP27 TP46 = CMP-0078143-3: TEST POINT.  No entry in BOM.; CompType: Testpoint; Manufacturer: N/A; PackageReference: N/A; PartNumber: N/A; Library Reference: TESTPOINT
U4 = CMP-0035419-1: Single Output High PSRR LDO, 200 mA, Fixed 3 V Output, 2.7 to 5.5 V Input, 5-pin SOT-23 (DBV), -40 to 85 degC, Green (RoHS & no Sb/Br); Manufacturer: Texas Instruments; Accuracy(%): 2; Fixed Output Options(V): 3; Iout(Max)(A): 0.2; Rating: Catalog; SubFamily: Single Channel LDO; Vdo(Typ)(mV): 112; Vin(Max)(V): 5.5; Vin(Min)(V): 2.7; Code_JEDEC: MO-178; ComponentLink1Description: Manufacturer URL; ComponentLink1URL: http://www.ti.com/; ComponentLink2Description: Datasheet; ComponentLink2URL: http://www.ti.com/general/docs/lit/getliterature.tsp?genericPartNumber=TPS79330&fileType=pdf; ComponentLink3Description: Package Specification; ComponentLink3URL: http://www.ti.com/litv/pdf/mpds018i; DatasheetVersion: SLVS348K; Eco-Plan: Green (RoHS & no Sb/Br); Iq(Typ)(mA): 0.2; Mounting Technology: Surface Mount; PackageDescription: 5-Pin Plastic Small Outline, Body 1.60 Ãƒâ€” 2.90 mm, Pitch 0.95 mm; PackageReference: DBV0005A; PackageVersion: 4073253-4/K; PartNumber: TPS79330DBVR; Vout Adj(Max)(V): 3; Vout Adj(Min)(V): 3
U8 = CMP-0083675-2: SimpleLink(TM) Bluetooth(R) 5 low energy Wireless MCU, RGZ0048A (VQFN-48); Alternate Manufacturer: Texas Instruments; Alternate PartNumber: CC2642R1FRGZT; SizeZ_mm: 1; AEC Category: Q200; SizeY_mm: 7; Rating: #N/A; SizeAreaWB_mm2: 81; AEC Qualified: N; CompType: IC; SizeArea_mm2: 49; PartNumber: CC2642R1FRGZR; Operating Temperature Range: -40 to 85 C; ComponentLink2URL: http://www.ti.com/product/cc2642r; ComponentLink2Description: Product Folder; PackageDescription: VQFN-48; ComponentLink3Description: Online Datasheet; PackageReference: RGZ0048A; MountType: SMT; ComponentLink1Description: Datasheet Link; SizeX_mm: 7; Manufacturer: Texas Instruments; ComponentLink1URL: http://www.ti.com/lit/ds/symlink/cc2642r.pdf; ComponentLink3URL: http://www.ti.com/product/cc2642r/datasheet
U10 = CMP-0043349-1: Low-Voltage 8-Bit I2C and SMBus I/O Expander, 1.65 to 5.5 V, -40 to 85 degC, 16-pin UQFN (RSV), Green (RoHS & no Sb/Br); Manufacturer: Texas Instruments; # of I/Os: 8; 5V Tolerant I/O: Yes; fSCLK(Max)(MHz): 400; I2C Address: 0100 00x; SubFamily: I2C IO Expander; VCC(Max)(V): 5.5; VCC(Min)(V): 1.65; Code_JEDEC: MO-288*; ComponentLink1Description: Datasheet; ComponentLink1URL: http://www.ti.com/general/docs/lit/getliterature.tsp?genericPartNumber=TCA6408A&fileType=pdf; ComponentLink2Description: Package Specification; ComponentLink2URL: http://www.ti.com/litv/pdf/mpqf115g; Configuration Registers: Yes; DatasheetVersion: SCPS192C; Eco-Plan: Green (RoHS & no Sb/Br); Interrupt Output: Yes; Low Power: Yes; Max Frequency(kHz): 400; Mounting Technology: Surface Mount; No. of Outputs: 8; PackageDescription: 16-Leads Plastic Quad Flatpack No-Lead, 2.6 x 1.8 x 0.5 mm Body, 0.4 mm Pitch; PackageReference: RSV0016A; PackageVersion: revD, Dec-2011; PartNumber: TCA6408ARSVR; Push-Pull I/O Type: Yes; Reset Input: Yes; Vcc range(V): 1.65 to 5.5
U14 = CMP-0860038-1: Automotive 4-Bit Bidirectional Voltage-Level Translator with Auto Direction Sensing and +/-15kV ESD, RUT0012A (UQFN-12); Alternate Manufacturer: Texas Instruments; AEC Category: Q200; AEC Qualified: Y; CompType: IC; SizeArea_mm2: 3.4; SizeAreaWB_mm2: 8.1; SizeX_mm: 1.7; SizeY_mm: 2; SizeZ_mm: 0.55; RoHS: Y; ComponentLink1Description: Datasheet Link; ComponentLink1URL: http://www.ti.com/lit/ds/symlink/txb0104-q1.pdf; ComponentLink2Description: Product Folder; ComponentLink2URL: http://www.ti.com/product/txb0104-q1; ComponentLink3Description: Online Datasheet; ComponentLink3URL: http://www.ti.com/product/txb0104-q1/datasheet; Manufacturer: Texas Instruments; MountType: SMT; Operating Temperature Range: -40 to 125 C; PackageDescription: UQFN-12; PackageReference: RUT0012A; PartNumber: TXB0104QRUTRQ1; Rating: Automotive
Y2 = CMP-0088076-1: 48MHz ±20ppm Crystal 7pF 50 Ohms 4-SMD, No Lead; Manufacturer: Kyocera; SizeZ_mm: 0.45mm; PartNumber: CX2016DB48000C0WPLA2; Frequency Tolerance: 20ppm; AEC Qualified: No; RoHS: TRUE; Symbol Name: SYM-CX2016DB48000C0WPLA2; ComponentLink1Description: Datasheet; Frequency_Fixed: 48MHz; Load Capacitance: 7pF; ComponentLink1URL: https://global.kyocera.com/prdct/electro/product/pdf/cx2016db_e.pdf; PackageReference: SMD4
Y3 = CMP-0088006-1: CRYSTAL 32.768KHZ 4PF SMD; Manufacturer: Abracon LLC; AEC Qualified: No; Frequency Tolerance: 20ppm; SizeZ_mm: 0.5mm; RoHS: TRUE; ComponentLink1Description: Datasheet; ComponentLink1URL: https://abracon.com/Resonators/ABS05W.pdf; Load Capacitance: 4pF; PackageReference: XTAL_SMT_1MM6_1MM0; PartNumber: ABS05W-32.768KHZ-D-2-T; Symbol Name: SYM-ABS05W-32.768KHZ-D-2-T